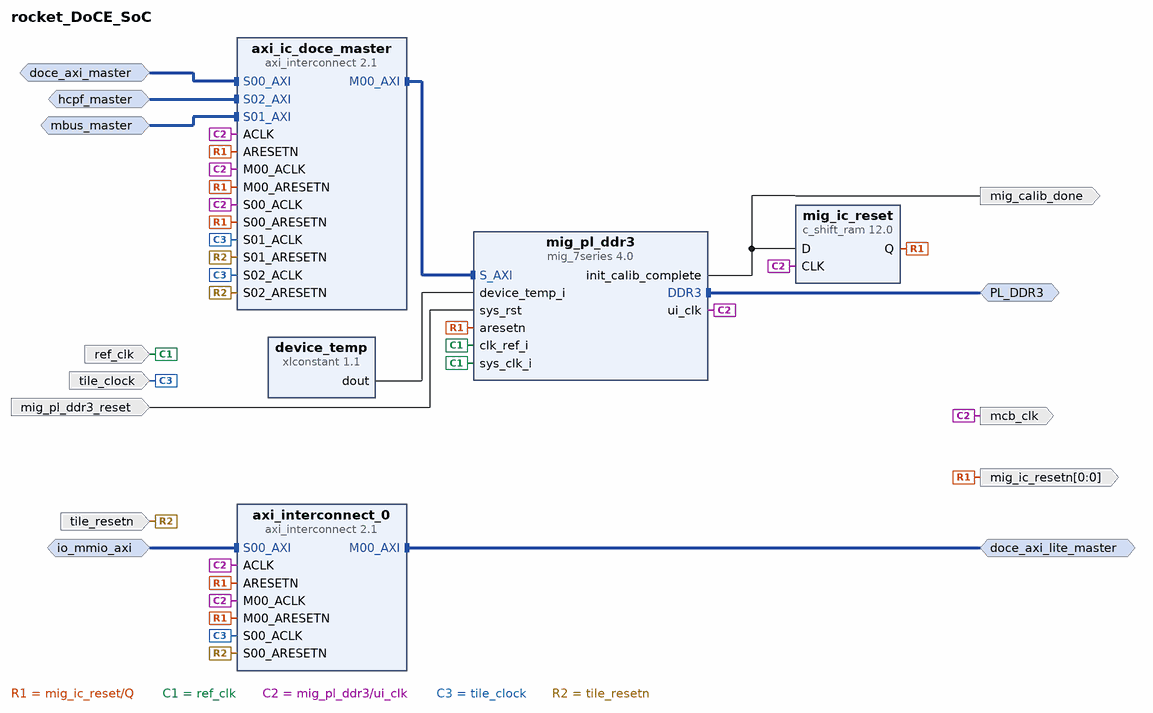
[diagram p0: block diagram of the top level]
# Vivado block design rocket_DoCE_SoC, xc7z045ffg900-2, Vivado 2017.4
create_bd_design rocket_DoCE_SoC

create_bd_intf_port -mode Master -vlnv xilinx.com:interface:ddrx_rtl:1.0 PL_DDR3
create_bd_intf_port -mode Slave -vlnv xilinx.com:interface:aximm_rtl:1.0 doce_axi_master
set_property -dict [list \
  CONFIG.DATA_WIDTH 32 \
  CONFIG.PROTOCOL AXI4 \
  CONFIG.ID_WIDTH 10 \
  CONFIG.ADDR_WIDTH 32 \
  CONFIG.AWUSER_WIDTH 0 \
  CONFIG.ARUSER_WIDTH 0 \
  CONFIG.WUSER_WIDTH 0 \
  CONFIG.RUSER_WIDTH 0 \
  CONFIG.BUSER_WIDTH 0 \
  CONFIG.READ_WRITE_MODE READ_WRITE \
  CONFIG.HAS_BURST 1 \
  CONFIG.HAS_LOCK 1 \
  CONFIG.HAS_PROT 1 \
  CONFIG.HAS_CACHE 1 \
  CONFIG.HAS_QOS 1 \
  CONFIG.HAS_REGION 1 \
  CONFIG.HAS_WSTRB 1 \
  CONFIG.HAS_BRESP 1 \
  CONFIG.HAS_RRESP 1 \
  CONFIG.SUPPORTS_NARROW_BURST 1 \
  CONFIG.NUM_READ_OUTSTANDING 1 \
  CONFIG.NUM_WRITE_OUTSTANDING 1 \
  CONFIG.MAX_BURST_LENGTH 256 \
  CONFIG.NUM_READ_THREADS 1 \
  CONFIG.NUM_WRITE_THREADS 1 \
  CONFIG.RUSER_BITS_PER_BYTE 0 \
  CONFIG.WUSER_BITS_PER_BYTE 0 \
] [get_bd_intf_ports doce_axi_master]
create_bd_intf_port -mode Slave -vlnv xilinx.com:interface:aximm_rtl:1.0 hcpf_master
set_property -dict [list \
  CONFIG.DATA_WIDTH 64 \
  CONFIG.PROTOCOL AXI4 \
  CONFIG.FREQ_HZ 200000000 \
  CONFIG.ID_WIDTH 2 \
  CONFIG.ADDR_WIDTH 32 \
  CONFIG.AWUSER_WIDTH 0 \
  CONFIG.ARUSER_WIDTH 0 \
  CONFIG.WUSER_WIDTH 0 \
  CONFIG.RUSER_WIDTH 0 \
  CONFIG.BUSER_WIDTH 0 \
  CONFIG.READ_WRITE_MODE READ_WRITE \
  CONFIG.HAS_BURST 1 \
  CONFIG.HAS_LOCK 1 \
  CONFIG.HAS_PROT 1 \
  CONFIG.HAS_CACHE 1 \
  CONFIG.HAS_QOS 1 \
  CONFIG.HAS_REGION 0 \
  CONFIG.HAS_WSTRB 1 \
  CONFIG.HAS_BRESP 1 \
  CONFIG.HAS_RRESP 1 \
  CONFIG.SUPPORTS_NARROW_BURST 1 \
  CONFIG.NUM_READ_OUTSTANDING 2 \
  CONFIG.NUM_WRITE_OUTSTANDING 2 \
  CONFIG.MAX_BURST_LENGTH 256 \
  CONFIG.PHASE 0.000 \
  CONFIG.CLK_DOMAIN ref_clk \
  CONFIG.NUM_READ_THREADS 1 \
  CONFIG.NUM_WRITE_THREADS 1 \
  CONFIG.RUSER_BITS_PER_BYTE 0 \
  CONFIG.WUSER_BITS_PER_BYTE 0 \
] [get_bd_intf_ports hcpf_master]
create_bd_intf_port -mode Slave -vlnv xilinx.com:interface:aximm_rtl:1.0 mbus_master
set_property -dict [list \
  CONFIG.DATA_WIDTH 64 \
  CONFIG.PROTOCOL AXI4 \
  CONFIG.FREQ_HZ 200000000 \
  CONFIG.ID_WIDTH 2 \
  CONFIG.ADDR_WIDTH 32 \
  CONFIG.AWUSER_WIDTH 0 \
  CONFIG.ARUSER_WIDTH 0 \
  CONFIG.WUSER_WIDTH 0 \
  CONFIG.RUSER_WIDTH 0 \
  CONFIG.BUSER_WIDTH 0 \
  CONFIG.READ_WRITE_MODE READ_WRITE \
  CONFIG.HAS_BURST 1 \
  CONFIG.HAS_LOCK 1 \
  CONFIG.HAS_PROT 1 \
  CONFIG.HAS_CACHE 1 \
  CONFIG.HAS_QOS 1 \
  CONFIG.HAS_REGION 0 \
  CONFIG.HAS_WSTRB 1 \
  CONFIG.HAS_BRESP 1 \
  CONFIG.HAS_RRESP 1 \
  CONFIG.SUPPORTS_NARROW_BURST 1 \
  CONFIG.NUM_READ_OUTSTANDING 2 \
  CONFIG.NUM_WRITE_OUTSTANDING 2 \
  CONFIG.MAX_BURST_LENGTH 256 \
  CONFIG.PHASE 0.000 \
  CONFIG.CLK_DOMAIN ref_clk \
  CONFIG.NUM_READ_THREADS 1 \
  CONFIG.NUM_WRITE_THREADS 1 \
  CONFIG.RUSER_BITS_PER_BYTE 0 \
  CONFIG.WUSER_BITS_PER_BYTE 0 \
] [get_bd_intf_ports mbus_master]
create_bd_intf_port -mode Slave -vlnv xilinx.com:interface:aximm_rtl:1.0 io_mmio_axi
set_property -dict [list \
  CONFIG.DATA_WIDTH 32 \
  CONFIG.PROTOCOL AXI4LITE \
  CONFIG.FREQ_HZ 200000000 \
  CONFIG.ID_WIDTH 0 \
  CONFIG.ADDR_WIDTH 32 \
  CONFIG.AWUSER_WIDTH 0 \
  CONFIG.ARUSER_WIDTH 0 \
  CONFIG.WUSER_WIDTH 0 \
  CONFIG.RUSER_WIDTH 0 \
  CONFIG.BUSER_WIDTH 0 \
  CONFIG.READ_WRITE_MODE READ_WRITE \
  CONFIG.HAS_BURST 1 \
  CONFIG.HAS_LOCK 1 \
  CONFIG.HAS_PROT 1 \
  CONFIG.HAS_CACHE 1 \
  CONFIG.HAS_QOS 1 \
  CONFIG.HAS_REGION 1 \
  CONFIG.HAS_WSTRB 1 \
  CONFIG.HAS_BRESP 1 \
  CONFIG.HAS_RRESP 1 \
  CONFIG.SUPPORTS_NARROW_BURST 0 \
  CONFIG.NUM_READ_OUTSTANDING 1 \
  CONFIG.NUM_WRITE_OUTSTANDING 1 \
  CONFIG.MAX_BURST_LENGTH 1 \
  CONFIG.CLK_DOMAIN ref_clk \
  CONFIG.NUM_READ_THREADS 1 \
  CONFIG.NUM_WRITE_THREADS 1 \
  CONFIG.RUSER_BITS_PER_BYTE 0 \
  CONFIG.WUSER_BITS_PER_BYTE 0 \
] [get_bd_intf_ports io_mmio_axi]
create_bd_intf_port -mode Master -vlnv xilinx.com:interface:aximm_rtl:1.0 doce_axi_lite_master
set_property -dict {CONFIG.DATA_WIDTH 32 CONFIG.PROTOCOL AXI4LITE CONFIG.ADDR_WIDTH 32} [get_bd_intf_ports doce_axi_lite_master]
create_bd_port -dir O -from 0 -to 0 -type rst mig_ic_resetn
create_bd_port -dir I -type clk ref_clk
set_property -dict {CONFIG.FREQ_HZ 200000000 CONFIG.PHASE 0.000 CONFIG.CLK_DOMAIN ref_clk} [get_bd_ports ref_clk]
create_bd_port -dir I -type rst mig_pl_ddr3_reset
set_property -dict {CONFIG.POLARITY ACTIVE_HIGH} [get_bd_ports mig_pl_ddr3_reset]
create_bd_port -dir O mig_calib_done
create_bd_port -dir O -type clk mcb_clk
set_property -dict [list \
  CONFIG.ASSOCIATED_BUSIF doce_axi_master:network_path_vfifo_axi_master:doce_axi_lite_master \
] [get_bd_ports mcb_clk]
create_bd_port -dir I -type clk tile_clock
set_property -dict [list \
  CONFIG.FREQ_HZ 200000000 \
  CONFIG.PHASE 0.000 \
  CONFIG.CLK_DOMAIN ref_clk \
  CONFIG.ASSOCIATED_BUSIF hcpf_master:mbus_master:io_mmio_axi \
  CONFIG.ASSOCIATED_RESET tile_resetn \
] [get_bd_ports tile_clock]
create_bd_port -dir I -type rst tile_resetn
set_property -dict {CONFIG.POLARITY ACTIVE_LOW} [get_bd_ports tile_resetn]

create_bd_cell -type ip -vlnv xilinx.com:ip:c_shift_ram:12.0 mig_ic_reset
set_property -dict {CONFIG.Width 1 CONFIG.Depth 2 CONFIG.DefaultData 0 CONFIG.AsyncInitVal 0} [get_bd_cells mig_ic_reset]
create_bd_cell -type ip -vlnv xilinx.com:ip:xlconstant:1.1 device_temp
set_property -dict {CONFIG.CONST_WIDTH 12 CONFIG.CONST_VAL 0} [get_bd_cells device_temp]
create_bd_cell -type ip -vlnv xilinx.com:ip:axi_interconnect:2.1 axi_ic_doce_master
set_property -dict [list \
  CONFIG.NUM_SI 3 \
  CONFIG.NUM_MI 1 \
  CONFIG.ENABLE_ADVANCED_OPTIONS 1 \
  CONFIG.XBAR_DATA_WIDTH 64 \
] [get_bd_cells axi_ic_doce_master]
create_bd_cell -type ip -vlnv xilinx.com:ip:mig_7series:4.0 mig_pl_ddr3
set_property -dict {CONFIG.XML_INPUT_FILE mig_a.prj} [get_bd_cells mig_pl_ddr3]
create_bd_cell -type ip -vlnv xilinx.com:ip:axi_interconnect:2.1 axi_interconnect_0
set_property -dict {CONFIG.NUM_MI 1} [get_bd_cells axi_interconnect_0]

# ---- connections ----

connect_bd_intf_net [get_bd_intf_pins axi_ic_doce_master/M00_AXI] [get_bd_intf_pins mig_pl_ddr3/S_AXI]
connect_bd_intf_net [get_bd_intf_ports PL_DDR3] [get_bd_intf_pins mig_pl_ddr3/DDR3]
connect_bd_intf_net [get_bd_intf_ports doce_axi_master] [get_bd_intf_pins axi_ic_doce_master/S00_AXI]
connect_bd_intf_net -intf_net S02_AXI_0_1 [get_bd_intf_ports hcpf_master] [get_bd_intf_pins axi_ic_doce_master/S02_AXI]
connect_bd_intf_net -intf_net S01_AXI_0_1 [get_bd_intf_ports mbus_master] [get_bd_intf_pins axi_ic_doce_master/S01_AXI]
connect_bd_intf_net -intf_net S00_AXI_0_1 [get_bd_intf_ports io_mmio_axi] [get_bd_intf_pins axi_interconnect_0/S00_AXI]
connect_bd_intf_net [get_bd_intf_ports doce_axi_lite_master] [get_bd_intf_pins axi_interconnect_0/M00_AXI]
connect_bd_net -net mig_ic_reset_n [get_bd_pins mig_ic_reset/Q] \
  [get_bd_ports mig_ic_resetn] [get_bd_pins mig_pl_ddr3/aresetn] [get_bd_pins axi_ic_doce_master/ARESETN] \
  [get_bd_pins axi_ic_doce_master/M00_ARESETN] [get_bd_pins axi_ic_doce_master/S00_ARESETN] \
  [get_bd_pins axi_interconnect_0/ARESETN] [get_bd_pins axi_interconnect_0/M00_ARESETN]
connect_bd_net [get_bd_ports ref_clk] [get_bd_pins mig_pl_ddr3/clk_ref_i] [get_bd_pins mig_pl_ddr3/sys_clk_i]
connect_bd_net [get_bd_pins device_temp/dout] [get_bd_pins mig_pl_ddr3/device_temp_i]
connect_bd_net [get_bd_ports mig_pl_ddr3_reset] [get_bd_pins mig_pl_ddr3/sys_rst]
connect_bd_net [get_bd_pins mig_pl_ddr3/init_calib_complete] [get_bd_ports mig_calib_done] [get_bd_pins mig_ic_reset/D]
connect_bd_net -net mcb_clk [get_bd_pins mig_pl_ddr3/ui_clk] \
  [get_bd_ports mcb_clk] [get_bd_pins mig_ic_reset/CLK] [get_bd_pins axi_ic_doce_master/ACLK] \
  [get_bd_pins axi_ic_doce_master/M00_ACLK] [get_bd_pins axi_ic_doce_master/S00_ACLK] [get_bd_pins axi_interconnect_0/ACLK] \
  [get_bd_pins axi_interconnect_0/M00_ACLK]
connect_bd_net [get_bd_ports tile_clock] \
  [get_bd_pins axi_ic_doce_master/S02_ACLK] [get_bd_pins axi_ic_doce_master/S01_ACLK] \
  [get_bd_pins axi_interconnect_0/S00_ACLK]
connect_bd_net [get_bd_ports tile_resetn] \
  [get_bd_pins axi_ic_doce_master/S02_ARESETN] [get_bd_pins axi_ic_doce_master/S01_ARESETN] \
  [get_bd_pins axi_interconnect_0/S00_ARESETN]

# ---- address map ----
assign_bd_address -offset 0x20000000 -range 256M -target_address_space [get_bd_addr_spaces doce_axi_master] [get_bd_addr_segs mig_pl_ddr3/memmap/memaddr]
assign_bd_address -offset 0x20000000 -range 256M -target_address_space [get_bd_addr_spaces hcpf_master] [get_bd_addr_segs mig_pl_ddr3/memmap/memaddr]
assign_bd_address -offset 0x60000000 -range 512M -target_address_space [get_bd_addr_spaces io_mmio_axi] [get_bd_addr_segs doce_axi_lite_master/Reg]
assign_bd_address -offset 0x20000000 -range 256M -target_address_space [get_bd_addr_spaces mbus_master] [get_bd_addr_segs mig_pl_ddr3/memmap/memaddr]

validate_bd_design
save_bd_design
